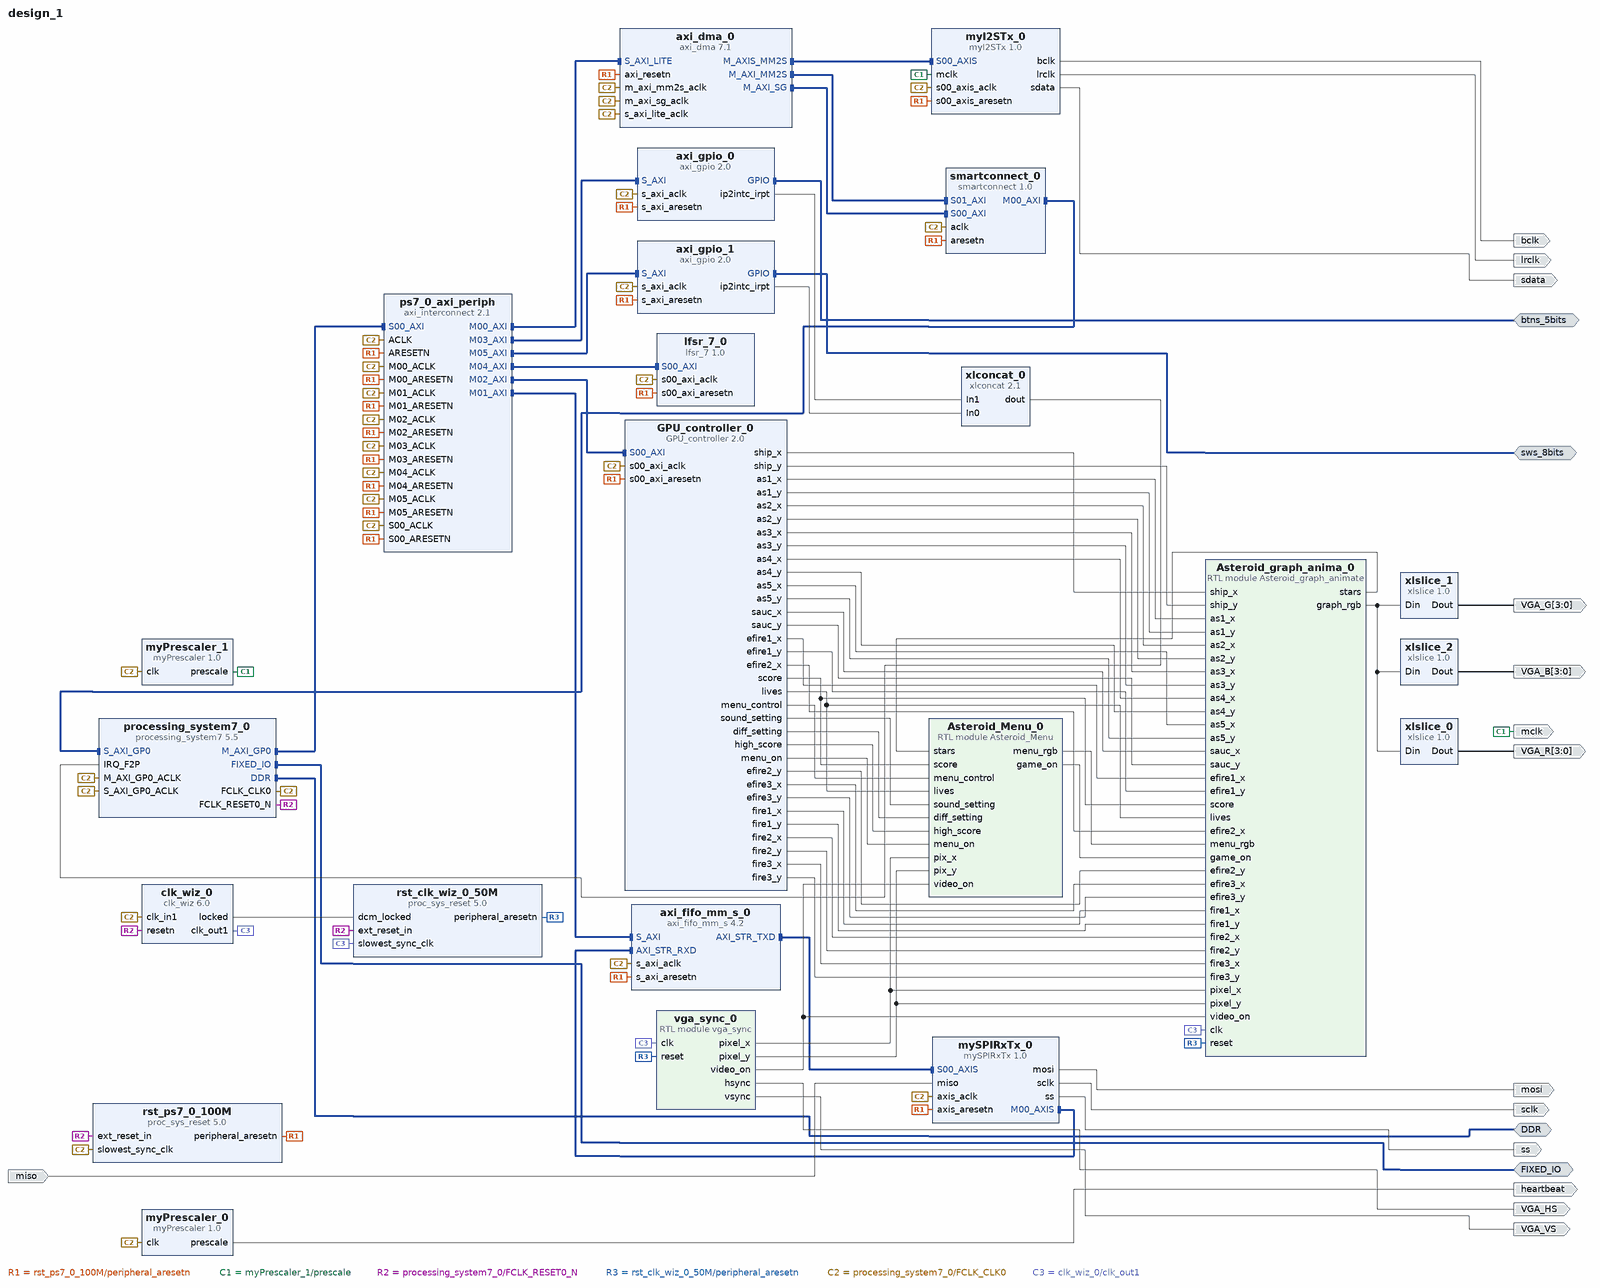
[diagram p0: block diagram of the top level]
# Vivado block design design_1, xc7z020clg484-1, Vivado 2020.2
create_bd_design design_1

create_bd_intf_port -mode Master -vlnv xilinx.com:interface:ddrx_rtl:1.0 DDR
create_bd_intf_port -mode Master -vlnv xilinx.com:display_processing_system7:fixedio_rtl:1.0 FIXED_IO
create_bd_intf_port -mode Master -vlnv xilinx.com:interface:gpio_rtl:1.0 btns_5bits
create_bd_intf_port -mode Master -vlnv xilinx.com:interface:gpio_rtl:1.0 sws_8bits
create_bd_port -dir O heartbeat
create_bd_port -dir O mclk
create_bd_port -dir O bclk
create_bd_port -dir O lrclk
create_bd_port -dir O sdata
create_bd_port -dir I -type data miso
create_bd_port -dir O -type data mosi
create_bd_port -dir O -type data sclk
create_bd_port -dir O -type intr ss
create_bd_port -dir O VGA_HS
create_bd_port -dir O VGA_VS
create_bd_port -dir O -from 3 -to 0 VGA_B
create_bd_port -dir O -from 3 -to 0 VGA_G
create_bd_port -dir O -from 3 -to 0 VGA_R

create_bd_cell -type ip -vlnv xilinx.com:ip:processing_system7:5.5 processing_system7_0
set_property -dict [list \
  CONFIG.PCW_APU_PERIPHERAL_FREQMHZ 666.666667 \
  CONFIG.PCW_ENET0_ENET0_IO {MIO 16 .. 27} \
  CONFIG.PCW_ENET0_GRP_MDIO_ENABLE 1 \
  CONFIG.PCW_ENET0_GRP_MDIO_IO {MIO 52 .. 53} \
  CONFIG.PCW_ENET0_PERIPHERAL_ENABLE 1 \
  CONFIG.PCW_ENET0_RESET_ENABLE 0 \
  CONFIG.PCW_ENET_RESET_ENABLE 1 \
  CONFIG.PCW_ENET_RESET_SELECT {Share reset pin} \
  CONFIG.PCW_FPGA0_PERIPHERAL_FREQMHZ 100.000000 \
  CONFIG.PCW_FPGA1_PERIPHERAL_FREQMHZ 150.000000 \
  CONFIG.PCW_GPIO_MIO_GPIO_ENABLE 1 \
  CONFIG.PCW_GPIO_MIO_GPIO_IO MIO \
  CONFIG.PCW_I2C_RESET_ENABLE 1 \
  CONFIG.PCW_IRQ_F2P_INTR 1 \
  CONFIG.PCW_PRESET_BANK1_VOLTAGE {LVCMOS 1.8V} \
  CONFIG.PCW_QSPI_GRP_SINGLE_SS_ENABLE 1 \
  CONFIG.PCW_QSPI_GRP_SINGLE_SS_IO {MIO 1 .. 6} \
  CONFIG.PCW_QSPI_PERIPHERAL_ENABLE 1 \
  CONFIG.PCW_QSPI_QSPI_IO {MIO 1 .. 6} \
  CONFIG.PCW_SD0_GRP_CD_ENABLE 1 \
  CONFIG.PCW_SD0_GRP_CD_IO {MIO 47} \
  CONFIG.PCW_SD0_GRP_WP_ENABLE 1 \
  CONFIG.PCW_SD0_GRP_WP_IO {MIO 46} \
  CONFIG.PCW_SD0_PERIPHERAL_ENABLE 1 \
  CONFIG.PCW_SD0_SD0_IO {MIO 40 .. 45} \
  CONFIG.PCW_SDIO_PERIPHERAL_FREQMHZ 50 \
  CONFIG.PCW_SINGLE_QSPI_DATA_MODE x4 \
  CONFIG.PCW_TTC0_PERIPHERAL_ENABLE 1 \
  CONFIG.PCW_TTC0_TTC0_IO EMIO \
  CONFIG.PCW_UART1_PERIPHERAL_ENABLE 1 \
  CONFIG.PCW_UART1_UART1_IO {MIO 48 .. 49} \
  CONFIG.PCW_UART_PERIPHERAL_FREQMHZ 50 \
  CONFIG.PCW_UIPARAM_DDR_FREQ_MHZ 533.333313 \
  CONFIG.PCW_UIPARAM_DDR_PARTNO {MT41J128M16 HA-15E} \
  CONFIG.PCW_USB0_PERIPHERAL_ENABLE 1 \
  CONFIG.PCW_USB0_RESET_ENABLE 0 \
  CONFIG.PCW_USB0_USB0_IO {MIO 28 .. 39} \
  CONFIG.PCW_USB_RESET_ENABLE 1 \
  CONFIG.PCW_USB_RESET_SELECT {Share reset pin} \
  CONFIG.PCW_USE_FABRIC_INTERRUPT 1 \
  CONFIG.PCW_USE_S_AXI_GP0 1 \
  CONFIG.preset ZedBoard \
] [get_bd_cells processing_system7_0]
# 224 more settings of processing_system7_0 are not shown: defaults, MIO pin electricals, DDR timing, and values the tool derives
create_bd_cell -type ip -vlnv xilinx.com:user:myI2STx:1.0 myI2STx_0
create_bd_cell -type ip -vlnv xilinx.com:user:myPrescaler:1.0 myPrescaler_0
set_property -dict {CONFIG.CounterWidth 25 CONFIG.ResetValue 33554431} [get_bd_cells myPrescaler_0]
create_bd_cell -type ip -vlnv xilinx.com:user:mySPIRxTx:1.0 mySPIRxTx_0
set_property -dict {CONFIG.sspol 1} [get_bd_cells mySPIRxTx_0]
create_bd_cell -type ip -vlnv xilinx.com:ip:axi_dma:7.1 axi_dma_0
set_property -dict [list \
  CONFIG.c_include_mm2s 1 \
  CONFIG.c_include_s2mm 0 \
  CONFIG.c_sg_include_stscntrl_strm 0 \
  CONFIG.c_sg_length_width 23 \
] [get_bd_cells axi_dma_0]
create_bd_cell -type ip -vlnv xilinx.com:ip:axi_interconnect:2.1 ps7_0_axi_periph
set_property -dict {CONFIG.NUM_MI 6} [get_bd_cells ps7_0_axi_periph]
create_bd_cell -type ip -vlnv xilinx.com:ip:proc_sys_reset:5.0 rst_ps7_0_100M
set_property -dict {CONFIG.C_AUX_RESET_HIGH 0} [get_bd_cells rst_ps7_0_100M]
create_bd_cell -type ip -vlnv xilinx.com:user:myPrescaler:1.0 myPrescaler_1
set_property -dict {CONFIG.CounterWidth 4 CONFIG.ResetValue 4} [get_bd_cells myPrescaler_1]
create_bd_cell -type ip -vlnv xilinx.com:ip:axi_fifo_mm_s:4.2 axi_fifo_mm_s_0
set_property -dict {CONFIG.C_HAS_AXIS_TSTRB true CONFIG.C_USE_TX_CTRL 0} [get_bd_cells axi_fifo_mm_s_0]
create_bd_cell -type ip -vlnv xilinx.com:ip:smartconnect:1.0 smartconnect_0
create_bd_cell -type ip -vlnv xilinx.com:ip:axi_gpio:2.0 axi_gpio_0
set_property -dict [list \
  CONFIG.C_INTERRUPT_PRESENT 1 \
  CONFIG.GPIO_BOARD_INTERFACE btns_5bits \
  CONFIG.USE_BOARD_FLOW true \
] [get_bd_cells axi_gpio_0]
create_bd_cell -type ip -vlnv xilinx.com:ip:clk_wiz:6.0 clk_wiz_0
set_property -dict [list \
  CONFIG.CLKOUT1_JITTER 151.636 \
  CONFIG.CLKOUT1_REQUESTED_OUT_FREQ 50 \
  CONFIG.CLK_IN1_BOARD_INTERFACE Custom \
  CONFIG.MMCM_CLKOUT0_DIVIDE_F 20.000 \
  CONFIG.RESET_PORT resetn \
  CONFIG.RESET_TYPE ACTIVE_LOW \
  CONFIG.USE_BOARD_FLOW true \
] [get_bd_cells clk_wiz_0]
create_bd_cell -type ip -vlnv xilinx.com:ip:proc_sys_reset:5.0 rst_clk_wiz_0_50M
create_bd_cell -type ip -vlnv xilinx.com:ip:xlslice:1.0 xlslice_0
set_property -dict {CONFIG.DIN_FROM 11 CONFIG.DIN_TO 8 CONFIG.DIN_WIDTH 12 CONFIG.DOUT_WIDTH 4} [get_bd_cells xlslice_0]
create_bd_cell -type ip -vlnv xilinx.com:ip:xlslice:1.0 xlslice_1
set_property -dict {CONFIG.DIN_FROM 3 CONFIG.DIN_TO 0 CONFIG.DIN_WIDTH 12 CONFIG.DOUT_WIDTH 4} [get_bd_cells xlslice_1]
create_bd_cell -type ip -vlnv xilinx.com:ip:xlslice:1.0 xlslice_2
set_property -dict {CONFIG.DIN_FROM 7 CONFIG.DIN_TO 4 CONFIG.DIN_WIDTH 12 CONFIG.DOUT_WIDTH 4} [get_bd_cells xlslice_2]
create_bd_cell -type ip -vlnv xilinx.com:user:lfsr_7:1.0 lfsr_7_0
create_bd_cell -type module -reference Asteroid_graph_animate Asteroid_graph_anima_0
create_bd_cell -type module -reference Asteroid_Menu Asteroid_Menu_0
create_bd_cell -type module -reference vga_sync vga_sync_0
create_bd_cell -type ip -vlnv xilinx.com:user:GPU_controller:2.0 GPU_controller_0
create_bd_cell -type ip -vlnv xilinx.com:ip:axi_gpio:2.0 axi_gpio_1
set_property -dict [list \
  CONFIG.C_INTERRUPT_PRESENT 1 \
  CONFIG.GPIO_BOARD_INTERFACE sws_8bits \
  CONFIG.USE_BOARD_FLOW true \
] [get_bd_cells axi_gpio_1]
create_bd_cell -type ip -vlnv xilinx.com:ip:xlconcat:2.1 xlconcat_0

# ---- connections ----

connect_bd_intf_net [get_bd_intf_pins ps7_0_axi_periph/M05_AXI] [get_bd_intf_pins axi_gpio_1/S_AXI]
connect_bd_intf_net [get_bd_intf_pins mySPIRxTx_0/M00_AXIS] [get_bd_intf_pins axi_fifo_mm_s_0/AXI_STR_RXD]
connect_bd_intf_net [get_bd_intf_pins ps7_0_axi_periph/M00_AXI] [get_bd_intf_pins axi_dma_0/S_AXI_LITE]
connect_bd_intf_net [get_bd_intf_ports FIXED_IO] [get_bd_intf_pins processing_system7_0/FIXED_IO]
connect_bd_intf_net [get_bd_intf_pins ps7_0_axi_periph/M04_AXI] [get_bd_intf_pins lfsr_7_0/S00_AXI]
connect_bd_intf_net [get_bd_intf_pins ps7_0_axi_periph/M03_AXI] [get_bd_intf_pins axi_gpio_0/S_AXI]
connect_bd_intf_net [get_bd_intf_ports btns_5bits] [get_bd_intf_pins axi_gpio_0/GPIO]
connect_bd_intf_net [get_bd_intf_pins ps7_0_axi_periph/M01_AXI] [get_bd_intf_pins axi_fifo_mm_s_0/S_AXI]
connect_bd_intf_net [get_bd_intf_pins axi_dma_0/M_AXI_MM2S] [get_bd_intf_pins smartconnect_0/S01_AXI]
connect_bd_intf_net [get_bd_intf_pins smartconnect_0/M00_AXI] [get_bd_intf_pins processing_system7_0/S_AXI_GP0]
connect_bd_intf_net [get_bd_intf_ports DDR] [get_bd_intf_pins processing_system7_0/DDR]
connect_bd_intf_net [get_bd_intf_pins axi_dma_0/M_AXIS_MM2S] [get_bd_intf_pins myI2STx_0/S00_AXIS]
connect_bd_intf_net [get_bd_intf_pins ps7_0_axi_periph/M02_AXI] [get_bd_intf_pins GPU_controller_0/S00_AXI]
connect_bd_intf_net [get_bd_intf_pins axi_fifo_mm_s_0/AXI_STR_TXD] [get_bd_intf_pins mySPIRxTx_0/S00_AXIS]
connect_bd_intf_net [get_bd_intf_pins processing_system7_0/M_AXI_GP0] [get_bd_intf_pins ps7_0_axi_periph/S00_AXI]
connect_bd_intf_net [get_bd_intf_pins axi_dma_0/M_AXI_SG] [get_bd_intf_pins smartconnect_0/S00_AXI]
connect_bd_intf_net [get_bd_intf_ports sws_8bits] [get_bd_intf_pins axi_gpio_1/GPIO]
connect_bd_net [get_bd_pins rst_ps7_0_100M/peripheral_aresetn] \
  [get_bd_pins ps7_0_axi_periph/S00_ARESETN] [get_bd_pins axi_dma_0/axi_resetn] [get_bd_pins ps7_0_axi_periph/M00_ARESETN] \
  [get_bd_pins ps7_0_axi_periph/ARESETN] [get_bd_pins myI2STx_0/s00_axis_aresetn] [get_bd_pins axi_fifo_mm_s_0/s_axi_aresetn] \
  [get_bd_pins ps7_0_axi_periph/M01_ARESETN] [get_bd_pins mySPIRxTx_0/axis_aresetn] [get_bd_pins smartconnect_0/aresetn] \
  [get_bd_pins ps7_0_axi_periph/M02_ARESETN] [get_bd_pins axi_gpio_0/s_axi_aresetn] \
  [get_bd_pins ps7_0_axi_periph/M03_ARESETN] [get_bd_pins ps7_0_axi_periph/M04_ARESETN] \
  [get_bd_pins lfsr_7_0/s00_axi_aresetn] [get_bd_pins GPU_controller_0/s00_axi_aresetn] \
  [get_bd_pins axi_gpio_1/s_axi_aresetn] [get_bd_pins ps7_0_axi_periph/M05_ARESETN]
connect_bd_net [get_bd_pins myPrescaler_0/prescale] [get_bd_ports heartbeat]
connect_bd_net [get_bd_pins myPrescaler_1/prescale] [get_bd_ports mclk] [get_bd_pins myI2STx_0/mclk]
connect_bd_net [get_bd_pins myI2STx_0/bclk] [get_bd_ports bclk]
connect_bd_net [get_bd_pins myI2STx_0/lrclk] [get_bd_ports lrclk]
connect_bd_net [get_bd_pins myI2STx_0/sdata] [get_bd_ports sdata]
connect_bd_net -net miso_0_1 [get_bd_ports miso] [get_bd_pins mySPIRxTx_0/miso]
connect_bd_net [get_bd_pins mySPIRxTx_0/mosi] [get_bd_ports mosi]
connect_bd_net [get_bd_pins mySPIRxTx_0/sclk] [get_bd_ports sclk]
connect_bd_net [get_bd_pins mySPIRxTx_0/ss] [get_bd_ports ss]
connect_bd_net [get_bd_pins processing_system7_0/FCLK_RESET0_N] \
  [get_bd_pins rst_ps7_0_100M/ext_reset_in] [get_bd_pins rst_clk_wiz_0_50M/ext_reset_in] [get_bd_pins clk_wiz_0/resetn]
connect_bd_net [get_bd_pins clk_wiz_0/locked] [get_bd_pins rst_clk_wiz_0_50M/dcm_locked]
connect_bd_net [get_bd_pins rst_clk_wiz_0_50M/peripheral_aresetn] [get_bd_pins Asteroid_graph_anima_0/reset] [get_bd_pins vga_sync_0/reset]
connect_bd_net [get_bd_pins processing_system7_0/FCLK_CLK0] \
  [get_bd_pins axi_dma_0/m_axi_mm2s_aclk] [get_bd_pins smartconnect_0/aclk] [get_bd_pins myI2STx_0/s00_axis_aclk] \
  [get_bd_pins axi_dma_0/m_axi_sg_aclk] [get_bd_pins axi_dma_0/s_axi_lite_aclk] [get_bd_pins ps7_0_axi_periph/M00_ACLK] \
  [get_bd_pins axi_fifo_mm_s_0/s_axi_aclk] [get_bd_pins ps7_0_axi_periph/M01_ACLK] [get_bd_pins mySPIRxTx_0/axis_aclk] \
  [get_bd_pins axi_gpio_0/s_axi_aclk] [get_bd_pins ps7_0_axi_periph/M03_ACLK] [get_bd_pins ps7_0_axi_periph/M02_ACLK] \
  [get_bd_pins myPrescaler_0/clk] [get_bd_pins myPrescaler_1/clk] [get_bd_pins processing_system7_0/M_AXI_GP0_ACLK] \
  [get_bd_pins ps7_0_axi_periph/S00_ACLK] [get_bd_pins processing_system7_0/S_AXI_GP0_ACLK] \
  [get_bd_pins ps7_0_axi_periph/ACLK] [get_bd_pins clk_wiz_0/clk_in1] [get_bd_pins rst_ps7_0_100M/slowest_sync_clk] \
  [get_bd_pins ps7_0_axi_periph/M04_ACLK] [get_bd_pins lfsr_7_0/s00_axi_aclk] [get_bd_pins GPU_controller_0/s00_axi_aclk] \
  [get_bd_pins axi_gpio_1/s_axi_aclk] [get_bd_pins ps7_0_axi_periph/M05_ACLK]
connect_bd_net [get_bd_pins GPU_controller_0/ship_x] [get_bd_pins Asteroid_graph_anima_0/ship_x]
connect_bd_net [get_bd_pins GPU_controller_0/ship_y] [get_bd_pins Asteroid_graph_anima_0/ship_y]
connect_bd_net [get_bd_pins GPU_controller_0/as1_x] [get_bd_pins Asteroid_graph_anima_0/as1_x]
connect_bd_net [get_bd_pins GPU_controller_0/as1_y] [get_bd_pins Asteroid_graph_anima_0/as1_y]
connect_bd_net [get_bd_pins GPU_controller_0/as2_x] [get_bd_pins Asteroid_graph_anima_0/as2_x]
connect_bd_net [get_bd_pins GPU_controller_0/as2_y] [get_bd_pins Asteroid_graph_anima_0/as2_y]
connect_bd_net [get_bd_pins GPU_controller_0/as3_x] [get_bd_pins Asteroid_graph_anima_0/as3_x]
connect_bd_net [get_bd_pins GPU_controller_0/as3_y] [get_bd_pins Asteroid_graph_anima_0/as3_y]
connect_bd_net [get_bd_pins GPU_controller_0/as4_x] [get_bd_pins Asteroid_graph_anima_0/as4_x]
connect_bd_net [get_bd_pins GPU_controller_0/as4_y] [get_bd_pins Asteroid_graph_anima_0/as4_y]
connect_bd_net [get_bd_pins GPU_controller_0/as5_x] [get_bd_pins Asteroid_graph_anima_0/as5_x]
connect_bd_net [get_bd_pins GPU_controller_0/as5_y] [get_bd_pins Asteroid_graph_anima_0/as5_y]
connect_bd_net [get_bd_pins GPU_controller_0/sauc_x] [get_bd_pins Asteroid_graph_anima_0/sauc_x]
connect_bd_net [get_bd_pins GPU_controller_0/sauc_y] [get_bd_pins Asteroid_graph_anima_0/sauc_y]
connect_bd_net [get_bd_pins GPU_controller_0/efire1_x] [get_bd_pins Asteroid_graph_anima_0/efire1_x]
connect_bd_net [get_bd_pins GPU_controller_0/efire1_y] [get_bd_pins Asteroid_graph_anima_0/efire1_y]
connect_bd_net [get_bd_pins GPU_controller_0/efire2_x] [get_bd_pins Asteroid_graph_anima_0/efire2_x]
connect_bd_net [get_bd_pins GPU_controller_0/efire2_y] [get_bd_pins Asteroid_graph_anima_0/efire2_y]
connect_bd_net [get_bd_pins GPU_controller_0/efire3_x] [get_bd_pins Asteroid_graph_anima_0/efire3_x]
connect_bd_net [get_bd_pins GPU_controller_0/efire3_y] [get_bd_pins Asteroid_graph_anima_0/efire3_y]
connect_bd_net [get_bd_pins GPU_controller_0/fire1_x] [get_bd_pins Asteroid_graph_anima_0/fire1_x]
connect_bd_net [get_bd_pins GPU_controller_0/fire1_y] [get_bd_pins Asteroid_graph_anima_0/fire1_y]
connect_bd_net [get_bd_pins GPU_controller_0/fire2_x] [get_bd_pins Asteroid_graph_anima_0/fire2_x]
connect_bd_net [get_bd_pins GPU_controller_0/fire2_y] [get_bd_pins Asteroid_graph_anima_0/fire2_y]
connect_bd_net [get_bd_pins GPU_controller_0/fire3_x] [get_bd_pins Asteroid_graph_anima_0/fire3_x]
connect_bd_net [get_bd_pins GPU_controller_0/fire3_y] [get_bd_pins Asteroid_graph_anima_0/fire3_y]
connect_bd_net [get_bd_pins GPU_controller_0/score] [get_bd_pins Asteroid_graph_anima_0/score] [get_bd_pins Asteroid_Menu_0/score]
connect_bd_net [get_bd_pins GPU_controller_0/lives] [get_bd_pins Asteroid_graph_anima_0/lives] [get_bd_pins Asteroid_Menu_0/lives]
connect_bd_net [get_bd_pins clk_wiz_0/clk_out1] \
  [get_bd_pins rst_clk_wiz_0_50M/slowest_sync_clk] [get_bd_pins Asteroid_graph_anima_0/clk] [get_bd_pins vga_sync_0/clk]
connect_bd_net [get_bd_pins GPU_controller_0/menu_control] [get_bd_pins Asteroid_Menu_0/menu_control]
connect_bd_net [get_bd_pins GPU_controller_0/sound_setting] [get_bd_pins Asteroid_Menu_0/sound_setting]
connect_bd_net [get_bd_pins GPU_controller_0/diff_setting] [get_bd_pins Asteroid_Menu_0/diff_setting]
connect_bd_net [get_bd_pins GPU_controller_0/high_score] [get_bd_pins Asteroid_Menu_0/high_score]
connect_bd_net [get_bd_pins Asteroid_Menu_0/menu_rgb] [get_bd_pins Asteroid_graph_anima_0/menu_rgb]
connect_bd_net -net GPU_controller_0_game_on [get_bd_pins GPU_controller_0/menu_on] [get_bd_pins Asteroid_Menu_0/menu_on]
connect_bd_net [get_bd_pins Asteroid_Menu_0/game_on] [get_bd_pins Asteroid_graph_anima_0/game_on]
connect_bd_net [get_bd_pins Asteroid_graph_anima_0/stars] [get_bd_pins Asteroid_Menu_0/stars]
connect_bd_net [get_bd_pins vga_sync_0/pixel_x] [get_bd_pins Asteroid_graph_anima_0/pixel_x] [get_bd_pins Asteroid_Menu_0/pix_x]
connect_bd_net [get_bd_pins vga_sync_0/pixel_y] [get_bd_pins Asteroid_graph_anima_0/pixel_y] [get_bd_pins Asteroid_Menu_0/pix_y]
connect_bd_net [get_bd_pins vga_sync_0/video_on] [get_bd_pins Asteroid_graph_anima_0/video_on] [get_bd_pins Asteroid_Menu_0/video_on]
connect_bd_net [get_bd_pins vga_sync_0/hsync] [get_bd_ports VGA_HS]
connect_bd_net [get_bd_pins vga_sync_0/vsync] [get_bd_ports VGA_VS]
connect_bd_net [get_bd_pins Asteroid_graph_anima_0/graph_rgb] [get_bd_pins xlslice_2/Din] [get_bd_pins xlslice_1/Din] [get_bd_pins xlslice_0/Din]
connect_bd_net [get_bd_pins xlslice_2/Dout] [get_bd_ports VGA_B]
connect_bd_net [get_bd_pins xlslice_1/Dout] [get_bd_ports VGA_G]
connect_bd_net [get_bd_pins xlslice_0/Dout] [get_bd_ports VGA_R]
connect_bd_net [get_bd_pins axi_gpio_1/ip2intc_irpt] [get_bd_pins xlconcat_0/In0]
connect_bd_net [get_bd_pins axi_gpio_0/ip2intc_irpt] [get_bd_pins xlconcat_0/In1]
connect_bd_net [get_bd_pins xlconcat_0/dout] [get_bd_pins processing_system7_0/IRQ_F2P]

# ---- address map ----
assign_bd_address -offset 0x00000000 -range 512M -target_address_space [get_bd_addr_spaces axi_dma_0/Data_MM2S] [get_bd_addr_segs processing_system7_0/S_AXI_GP0/GP0_DDR_LOWOCM]
assign_bd_address -offset 0x00000000 -range 512M -target_address_space [get_bd_addr_spaces axi_dma_0/Data_SG] [get_bd_addr_segs processing_system7_0/S_AXI_GP0/GP0_DDR_LOWOCM]
assign_bd_address -offset 0x40400000 -range 64K -target_address_space [get_bd_addr_spaces processing_system7_0/Data] [get_bd_addr_segs axi_dma_0/S_AXI_LITE/Reg]
assign_bd_address -offset 0x41200000 -range 64K -target_address_space [get_bd_addr_spaces processing_system7_0/Data] [get_bd_addr_segs axi_gpio_0/S_AXI/Reg]
assign_bd_address -offset 0x41210000 -range 64K -target_address_space [get_bd_addr_spaces processing_system7_0/Data] [get_bd_addr_segs axi_gpio_1/S_AXI/Reg]
assign_bd_address -offset 0x43C00000 -range 64K -target_address_space [get_bd_addr_spaces processing_system7_0/Data] [get_bd_addr_segs axi_fifo_mm_s_0/S_AXI/Mem0]
assign_bd_address -offset 0x43C10000 -range 64K -target_address_space [get_bd_addr_spaces processing_system7_0/Data] [get_bd_addr_segs GPU_controller_0/S00_AXI/S00_AXI_reg]
assign_bd_address -offset 0x43C20000 -range 64K -target_address_space [get_bd_addr_spaces processing_system7_0/Data] [get_bd_addr_segs lfsr_7_0/S00_AXI/S00_AXI_reg]

validate_bd_design
save_bd_design
